# EAGLE design avr-doper-alt (EAGLE 5.06)
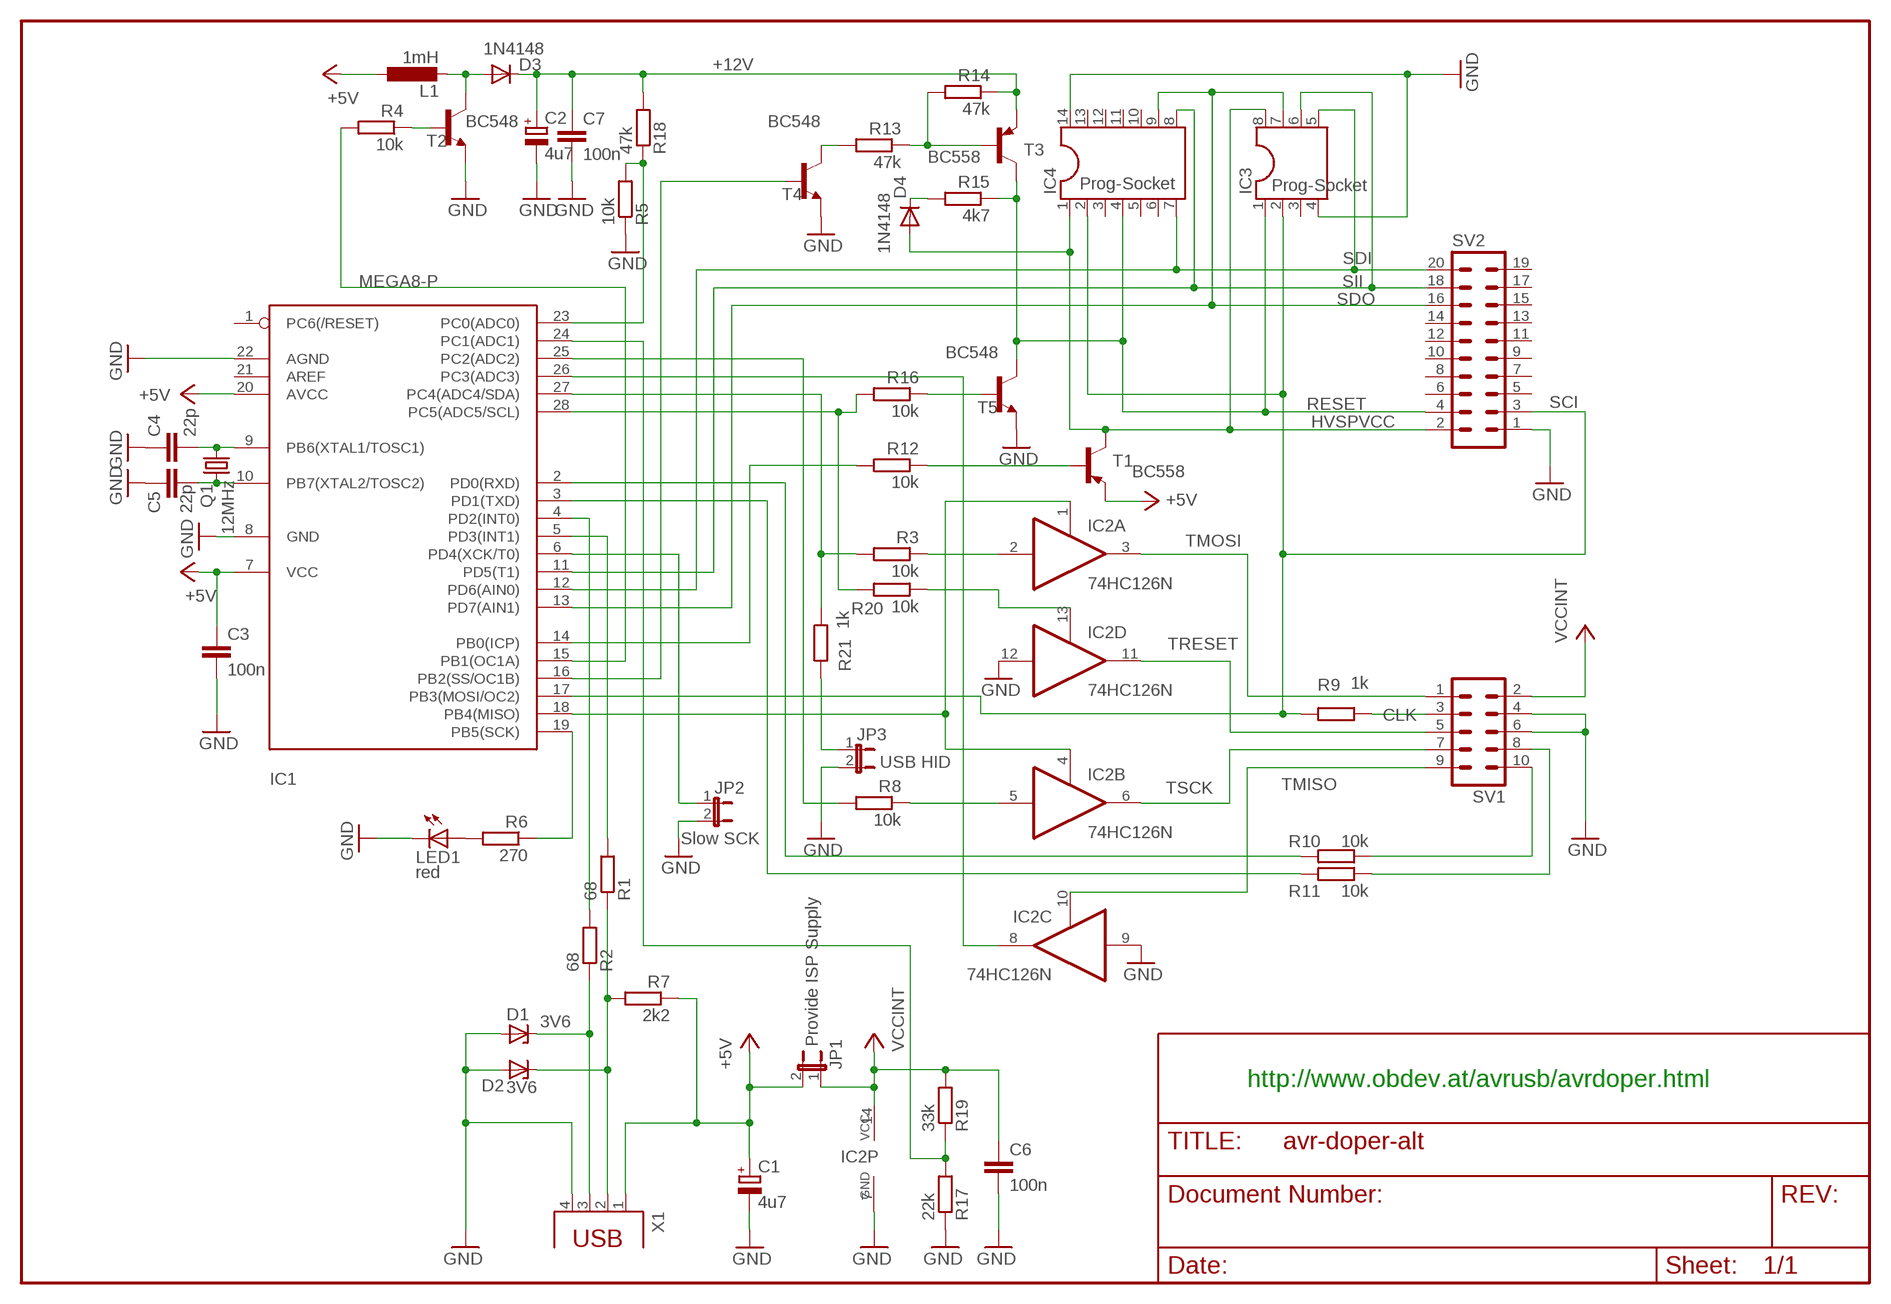
[diagram p0: schematic, sheet 1]

## Parts
C1  4u7  CPOL-EUE2.5-5  [E2,5-5]
C2  4u7  CPOL-EUE2.5-5  [E2,5-5]
C3  100n  C-EU025-024X044  [C025-024X044]
C4  22p  C-EU025-024X044  [C025-024X044]
C5  22p  C-EU025-024X044  [C025-024X044]
C6  100n  C-EU025-024X044  [C025-024X044]
C7  100n  C-EU025-024X044  [C025-024X044]
D1  3V6  ZENER-DIODEDO35Z10  [DO35Z10]
D2  3V6  ZENER-DIODEDO34-7  [DO34Z7]
D3  1N4148  1N41487MM  [DO35-7]
D4  1N4148  1N41487MM  [DO35-7]
IC1  MEGA8-P  [DIL28-3]
IC2  74HC126N  [DIL14]
IC3  Prog-Socket  DIL8S  [SOCKED-08]
IC4  Prog-Socket  DIL14S  [SOCKED-14]
JP1  Provide ISP Supply  JP1E  [JP1]
JP2  Slow SCK  JP1E  [JP1]
JP3  USB HID  JP1E  [JP1]
L1  1mH  L-EU0207/10  [0207/10]
LED1  red  LED3MM  [LED3MM]
Q1  12MHz  CRYTALHC49S  [HC49/S]
R1  68  R-EU_0207/12  [0207/12]
R2  68  R-EU_0207/10  [0207/10]
R3  10k  R-EU_0207/10  [0207/10]
R4  10k  R-EU_0207/10  [0207/10]
R5  10k  R-EU_0207/10  [0207/10]
R6  270  R-EU_0207/10  [0207/10]
R7  2k2  R-EU_0207/10  [0207/10]
R8  10k  R-EU_0207/10  [0207/10]
R9  1k  R-EU_0207/10  [0207/10]
R10  10k  R-EU_0207/10  [0207/10]
R11  10k  R-EU_0207/10  [0207/10]
R12  10k  R-EU_0207/10  [0207/10]
R13  47k  R-EU_0207/10  [0207/10]
R14  47k  R-EU_0207/10  [0207/10]
R15  4k7  R-EU_0207/10  [0207/10]
R16  10k  R-EU_0207/10  [0207/10]
R17  22k  R-EU_0207/10  [0207/10]
R18  47k  R-EU_0207/10  [0207/10]
R19  33k  R-EU_0207/15  [0207/15]
R20  10k  R-EU_0207/10  [0207/10]
R21  1k  R-EU_0207/12  [0207/12]
SV1  ML10L  [ML10L]
SV2  ML20L  [ML20L]
T1  BC558  -PNP-TO92/  [TO92/]
T2  BC548  2N930-NPN-TO18-EBC  [TO18]
T3  BC558  -PNP-TO92/  [TO92/]
T4  BC548  2N930-NPN-TO18-EBC  [TO18]
T5  BC548  2N930-NPN-TO18-EBC  [TO18]
X1  PN61729  [PN61729]

## Nets
+5V: C1.+ C3.1 IC1.7(VCC) IC1.20(AVCC) JP1.2 L1.1 R7.1 T1.1(E) X1.1
+12V: C2.+ C7.1 D3.C R14.1 R18.2 T3.1(E)
CLK: R9.1 SV1.3
GND: C1.- C2.- C3.2 C4.1 C5.1 C6.2 C7.2 D1.A D2.A IC1.8(GND) IC1.22(AGND) IC2.7(P:GND) IC2.9(C:I) IC2.12(D:I) IC3.4 IC4.14 JP2.2 JP3.2 LED1.K(C) R5.1 R17.1 SV1.4 SV1.6 SV2.1 T2.1(E) T4.1(E) T5.1(E) X1.4
HVSPVCC: D4.A IC3.8 IC4.1 SV2.2 T1.3(C)
N$1: IC1.18(PB4(MISO)) IC2.1(A:OE) IC2.4(B:OE)
N$2: IC2.2(A:I) R3.1
N$3: IC2.5(B:I) R8.1
N$4: IC1.27(PC4(ADC4/SDA)) R3.2 R21.1
N$5: D2.C R1.1 R7.2 X1.2
N$6: IC1.25(PC2(ADC2)) R8.2
N$7: IC1.4(PD2(INT0)) R2.2
N$8: D1.C R2.1 X1.3
N$9: IC1.28(PC5(ADC5/SCL)) R16.2 R20.2
N$10: IC1.26(PC3(ADC3)) IC2.8(C:O)
N$11: IC1.24(PC1(ADC1)) R17.2 R19.1
N$12: R10.1 SV1.10
N$13: IC1.2(PD0(RXD)) R10.2
N$14: IC1.3(PD1(TXD)) R11.2
N$15: R11.1 SV1.8
N$18: R12.1 T1.2(B)
N$19: IC1.14(PB0(ICP)) R12.2
N$20: IC2.13(D:OE) R20.1
N$21: IC1.5(PD3(INT1)) R1.2
N$22: C4.2 IC1.9(PB6(XTAL1/TOSC1)) Q1.2
N$23: C5.2 IC1.10(PB7(XTAL2/TOSC2)) Q1.1
N$25: LED1.A R6.2
N$26: IC1.15(PB1(OC1A)) R4.2
N$27: D3.A L1.2 T2.3(C)
N$29: R4.1 T2.2(B)
N$30: R13.2 T4.3(C)
N$31: R13.1 R14.2 T3.2(B)
N$32: JP3.1 R21.2
N$33: IC1.23(PC0(ADC0)) R5.2 R18.1
N$34: D4.C R15.2
N$35: R16.1 T5.2(B)
N$37: IC1.16(PB2(SS/OC1B)) T4.2(B)
N$38: IC1.6(PD4(XCK/T0)) JP2.1
N$39: IC1.19(PB5(SCK)) R6.1
RESET: IC3.1 IC4.4 R15.1 SV2.4 T3.3(C) T5.3(C)
SCI: IC1.17(PB3(MOSI/OC2)) IC3.2 IC4.2 R9.2 SV2.3
SDI: IC1.12(PD6(AIN0)) IC3.5 IC4.7 SV2.20
SDO: IC1.13(PD7(AIN1)) IC3.7 IC4.9 SV2.16
SII: IC1.11(PD5(T1)) IC3.6 IC4.8 SV2.18
TMISO: IC2.10(C:OE) SV1.9
TMOSI: IC2.3(A:O) SV1.1
TRESET: IC2.11(D:O) SV1.5
TSCK: IC2.6(B:O) SV1.7
VCCINT: C6.1 IC2.14(P:VCC) JP1.1 R19.2 SV1.2
Unconnected: IC1.1(PC6(/RESET)) IC1.21(AREF) IC3.3 IC4.3 IC4.5 IC4.6 IC4.10 IC4.11 IC4.12 IC4.13 SV2.5 SV2.6 SV2.7 SV2.8 SV2.9 SV2.10 SV2.11 SV2.12 SV2.13 SV2.14 SV2.15 SV2.17 SV2.19

## Notes on the sheet
- http://www.obdev.at/avrusb/avrdoper.html

## Library data of the parts
C1 C2 = rcl:CPOL-EU: POLARIZED CAPACITOR, European symbol
C3-C7 = rcl:C-EU: CAPACITOR, European symbol
D1 D2 = diode:ZENER-DIODE: Z-Diode
D3 D4 = diode:1N4148: DIODE high speed (Philips)
IC1 = atmel:MEGA8-P: MICROCONTROLLER 8 Kbytes FLASH 1 kbytes SRAM 512 bytes EEPROM USART 4-channel 10 bit ADC 2-channel 8 bit ADC Source: avr.lbr
IC2 = 74xx-eu:74*126: Quad bus BUFFER, 3-state
IC3 = ic-package:DIL8: Dual In Line
IC4 = ic-package:DIL14: Dual In Line
JP1-JP3 = jumper:JP1E: JUMPER
L1 = rcl:L-EU: INDUCTOR, European symbol
LED1 = led:LED: LED OSRAM: - CHIPLED LG R971, LG N971, LY N971, LG Q971, LY Q971, LO R971, LY R971 LH N974, LH R974 LS Q976, LO Q976, LY Q976 LO Q996 - Hyper CHIPLED LW Q18S LB Q993, LB Q99A, LB R99A - SideLED LS A670, LO A670, LY A670, LG A670, LP A670 LB A673, LV A673, LT A673, LW A673 LH A674 LY A675 LS A676, LA A676, LO A676, LY A676, LW A676 LS A679, LY A679, LG A679 - Hyper Micro SIDELED® LS Y876, LA Y876, LO Y876, LY Y876 LT Y87S - SmartLED LW L88C, LW L88S LB L89C, LB L89S, LG L890 LS L89K, LO L89K, LY L89K LS L896, LA L896, LO L896, LY L896 - TOPLED LS T670, LO T670, LY T670, LG T670, LP T670 LSG T670, LSP T670, LSY T670, LOP T670, LYG T670 LG T671, LOG T671, LSG T671 LB T673, LV T673, LT T673, LW T673 LH T674 LS T676, LA T676, LO T676, LY T676, LB T676, LH T676, LSB T676, LW T676 LB T67C, LV T67C, LT T67C, LS T67K, LO T67K, LY T67K, LW E67C LS E67B, LA E67B, LO E67B, LY E67B, LB E67C, LV E67C, LT E67C LW T67C LS T679, LY T679, LG T679 LS T770, LO T770, LY T770, LG T770, LP T770 LB T773, LV T773, LT T773, LW T773 LH T774 LS E675, LA E675, LY E675, LS T675 LS T776, LA T776, LO T776, LY T776, LB T776 LHGB T686 LT T68C, LB T68C - Hyper Mini TOPLED® LB M676 - Mini TOPLED Santana® LG M470 LS M47K, LO M47K, LY M47K Source: http://www.osram.convergy.de/
Q1 = crystal:CRYTAL: CRYSTAL
R1-R21 = rcl:R-EU_: RESISTOR, European symbol
SV1 = con-harting-ml:ML10: HARTING
SV2 = con-harting-ml:ML20: HARTING
T1 T3 = transistor:*-PNP-: PNP Transistror
T2 T4 T5 = transistor:*-NPN-: NPN Transistror
X1 = con-berg:PN61729: BERG USB connector

## Board
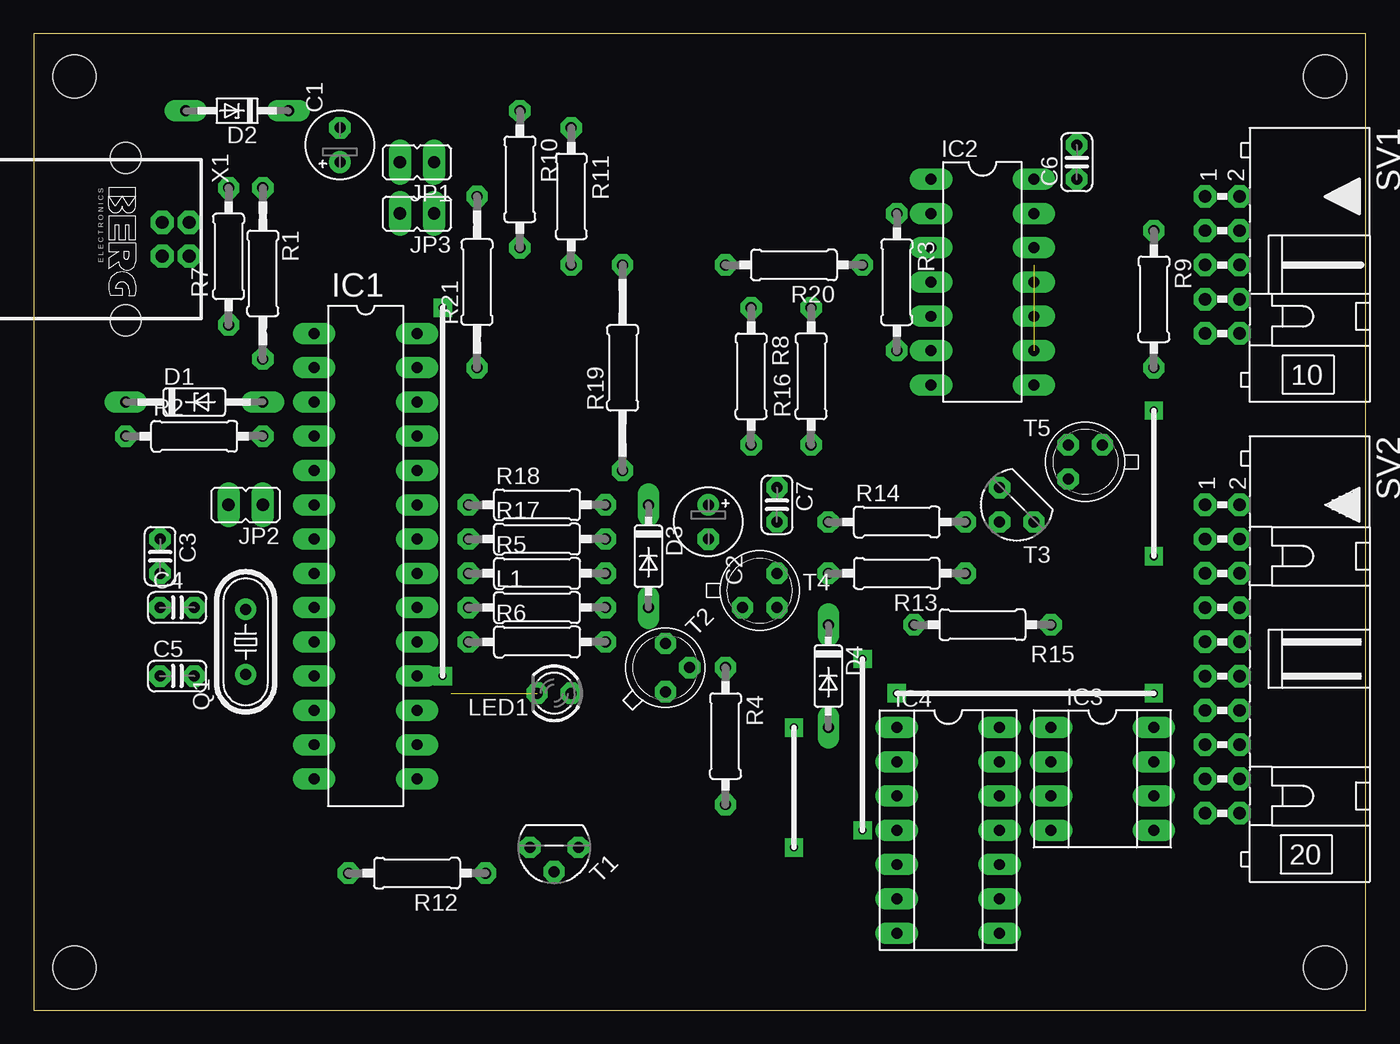
[diagram p1: board, top side]
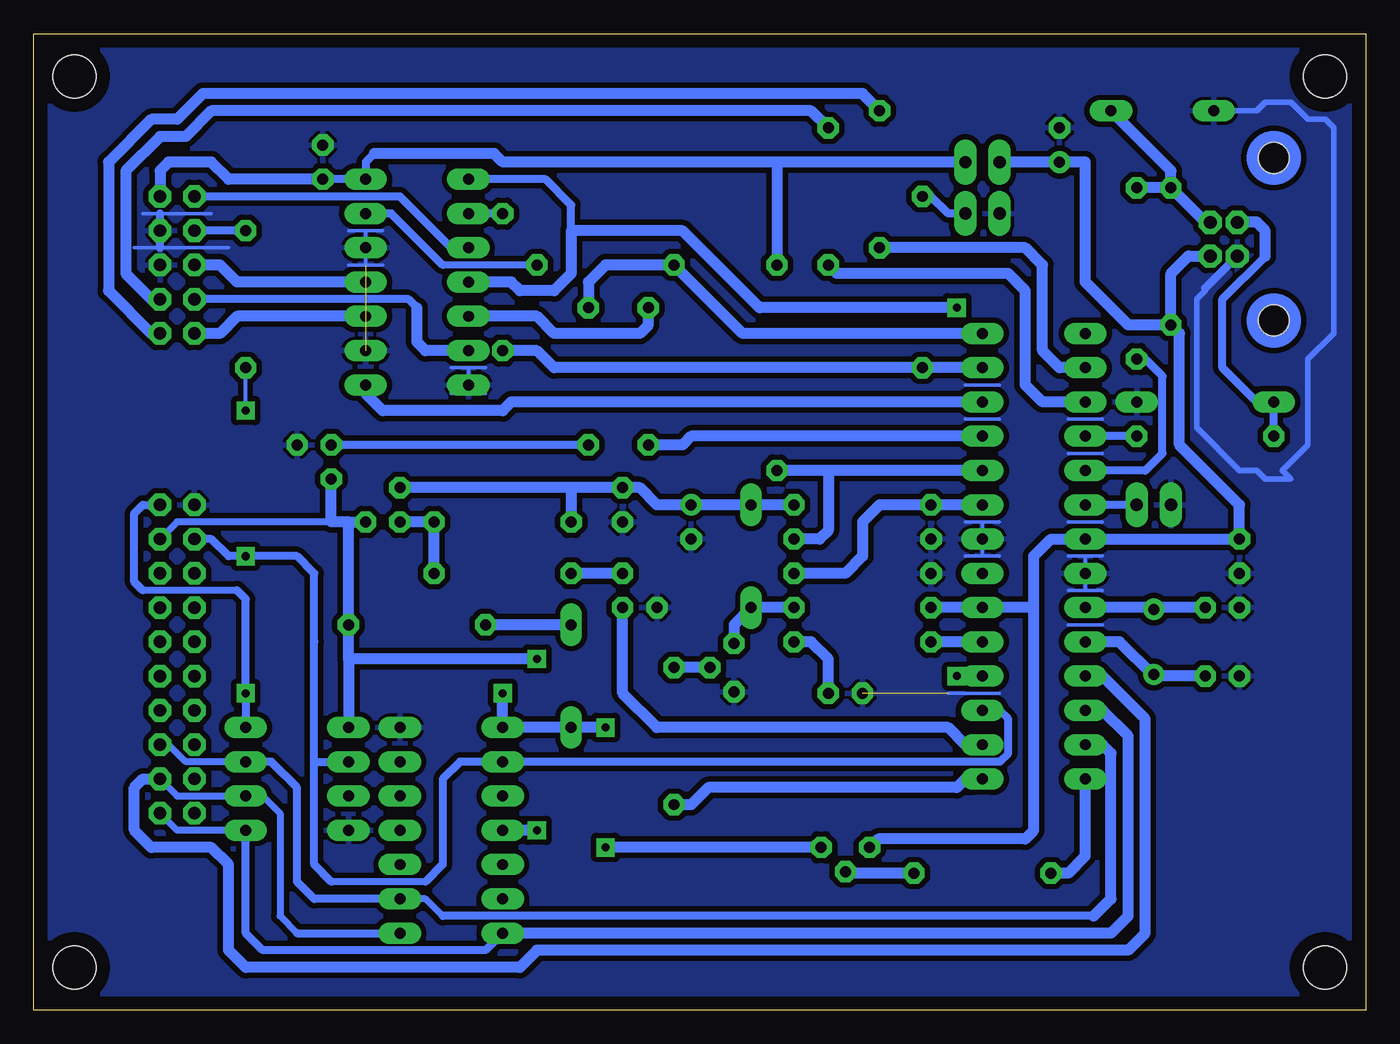
[diagram p2: board, bottom side, seen from below]

Size 98.73 x 72.38 mm. Coordinates in mm from the lower left corner, seen from the top.
Outline: 0,0 98.73,0 98.73,72.38 0,72.38 0,0
Copper layers 16: Bottom 0.035mm
Design rules "default": minimum track width 12mil, minimum drill 31mil, track to track 8mil, track to pad 8mil, pad to pad 8mil, via to via 8mil, smd to smd 8mil, copper to edge 40mil, drill to drill 8mil, minimum pad ring 15mil, minimum via ring 15mil, stop-mask expansion 4mil, vias tented up to drill 0mil, thermal gap 10mil
Holes 3.2 mm at 3.01,69.21 3.01,3.17 95.72,3.17 95.72,69.21

### Footprints (pad centres in the part's own frame; a part is rotated, then mirrored left to right if it is on the bottom)
E2,5-5 = drill 0.813 pad 1.6 round: + -1.27,0 | drill 0.813 pad 1.6 octagon: - 1.27,0
C025-024X044 = drill 0.813 octagon: 1 -1.27,0; 2 1.27,0
DO35Z10 = drill 0.813 long: A 5.08,0; C -5.08,0
DO34Z7 = drill 0.813 long: A 3.81,0; C -3.81,0
DO35-7 = drill 0.813 long: A 3.81,0; C -3.81,0
DIL28-3 = drill 0.813 long: 1 -16.51,-3.81; 2 -13.97,-3.81; 3 -11.43,-3.81; 4 -8.89,-3.81; 5 -6.35,-3.81; 6 -3.81,-3.81; 7 -1.27,-3.81; 8 1.27,-3.81; 9 3.81,-3.81; 10 6.35,-3.81; 11 8.89,-3.81; 12 11.43,-3.81; 13 13.97,-3.81; 14 16.51,-3.81; 15 16.51,3.81; 16 13.97,3.81; 17 11.43,3.81; 18 8.89,3.81; 19 6.35,3.81; 20 3.81,3.81; 21 1.27,3.81; 22 -1.27,3.81; 23 -3.81,3.81; 24 -6.35,3.81; 25 -8.89,3.81; 26 -11.43,3.81; 27 -13.97,3.81; 28 -16.51,3.81
DIL14 = drill 0.813 long: 1 -7.62,-3.81; 2 -5.08,-3.81; 3 -2.54,-3.81; 4 0,-3.81; 5 2.54,-3.81; 6 5.08,-3.81; 7 7.62,-3.81; 8 7.62,3.81; 9 5.08,3.81; 10 2.54,3.81; 11 0,3.81; 12 -2.54,3.81; 13 -5.08,3.81; 14 -7.62,3.81
SOCKED-08 = drill 0.813 long: 1 -3.81,-3.81; 2 -1.27,-3.81; 3 1.27,-3.81; 4 3.81,-3.81; 5 3.81,3.81; 6 1.27,3.81; 7 -1.27,3.81; 8 -3.81,3.81
SOCKED-14 = drill 0.813 long: 1 -7.62,-3.81; 2 -5.08,-3.81; 3 -2.54,-3.81; 4 0,-3.81; 5 2.54,-3.81; 6 5.08,-3.81; 7 7.62,-3.81; 8 7.62,3.81; 9 5.08,3.81; 10 2.54,3.81; 11 0,3.81; 12 -2.54,3.81; 13 -5.08,3.81; 14 -7.62,3.81
JP1 = drill 0.914 long: 1 0,-1.27; 2 0,1.27
0207/10 = drill 0.813 octagon: 1 -5.08,0; 2 5.08,0
LED3MM = drill 0.813 octagon: A -1.27,0; K 1.27,0
HC49/S = drill 0.813 round: 1 -2.413,0; 2 2.413,0
0207/12 = drill 0.813 octagon: 1 -6.35,0; 2 6.35,0
0207/15 = drill 0.813 octagon: 1 -7.62,0; 2 7.62,0
ML10L = drill 0.914 octagon: 1 -5.08,-1.27; 2 -5.08,1.27; 3 -2.54,-1.27; 4 -2.54,1.27; 5 0,-1.27; 6 0,1.27; 7 2.54,-1.27; 8 2.54,1.27; 9 5.08,-1.27; 10 5.08,1.27
ML20L = drill 0.914 octagon: 1 -11.43,-1.27; 2 -11.43,1.27; 3 -8.89,-1.27; 4 -8.89,1.27; 5 -6.35,-1.27; 6 -6.35,1.27; 7 -3.81,-1.27; 8 -3.81,1.27; 9 -1.27,-1.27; 10 -1.27,1.27; 11 1.27,-1.27; 12 1.27,1.27; 13 3.81,-1.27; 14 3.81,1.27; 15 6.35,-1.27; 16 6.35,1.27; 17 8.89,-1.27; 18 8.89,1.27; 19 11.43,-1.27; 20 11.43,1.27
TO92/ = drill 0.813 octagon: 1 1.27,-1.27; 2 1.27,1.27; 3 -1.27,1.27
TO18 = drill 0.813 octagon: 1 -1.27,-1.27; 2 1.27,-1.27; 3 1.27,1.27
PN61729 = drill 0.95 octagon: 1 1.25,4.71; 2 -1.25,4.71; 3 -1.25,2.71; 4 1.25,2.71 | hole 2.3: -6.02,0; 6.02,0

### Placement (x,y rotation side)
C1  22.7,64.13 90 top
C2  50,36.19 270 top
C3  9.36,33.65 270 top
C4  10.63,29.84 0 top
C5  10.63,24.76 0 top
C6  77.3,62.86 90 top
C7  55.08,37.46 270 top
D1  11.9,45.08 0 top
D2  15.08,66.67 180 top
D3  45.55,33.65 270 top
D4  58.89,24.76 270 top
IC1  24.6,33.65 270 top
IC2  70.32,53.97 270 top
IC3  79.21,17.14 270 top
IC4  67.78,13.33 270 top
JP1  28.41,62.86 90 top
JP2  15.71,37.46 90 top
JP3  28.41,59.05 90 top
L1  37.3,29.84 0 top
LED1  38.57,23.49 180 top
Q1  15.71,27.3 90 top
R1  16.98,54.61 270 top
R2  11.9,42.54 0 top
R3  63.97,53.97 270 top
R4  51.27,20.31 270 top
R5  37.3,32.38 0 top
R6  37.3,27.3 0 top
R7  14.44,55.88 90 top
R8  53.17,46.98 270 top
R9  83.02,52.7 270 top
R10  36.03,61.59 270 top
R11  39.84,60.32 270 top
R12  28.41,10.16 180 top
R13  63.97,32.38 180 top
R14  63.97,36.19 0 top
R15  70.32,28.57 180 top
R16  57.62,46.98 90 top
R17  37.3,34.92 0 top
R18  37.3,37.46 0 top
R19  43.65,47.62 90 top
R20  56.35,55.24 180 top
R21  32.85,53.97 90 top
SV1  88.1,55.24 270 top
SV2  88.1,26.03 270 top
T1  38.57,12.06 225 top
T2  46.82,25.39 45 top
T3  72.86,37.46 180 top
T4  53.81,31.11 0 top
T5  77.94,40.64 180 top
X1  6.82,57.15 270 top

### Tracks (layer width: path | path; a pad name or v marks a point on that pad's centre or on a via)
+5V
  Bottom 0.813: L1.1 IC1.20 24.6,29.84 | 24.6,29.84 24.6,33.65 23.33,34.92 IC1.7 C3.1 9.36,37.46 13.81,41.91 13.81,50.16 R7.1 | T1.1 36.14,12.7 25.23,12.7 24.6,13.33 24.6,29.84 | R7.1 17.61,50.8 20.79,53.97 20.79,62.86 C1.+ JP1.2 | R7.1 14.44,54.61 13.15,55.9 X1.1
+12V
  Bottom 0.813: R18.2 D3.C C2.+ 52.54,37.46 53.81,38.73 C7.1 58.89,38.73 | 58.89,38.73 R14.1 | 58.89,38.73 T3.1
CLK
  Bottom 0.61: R9.1 SV1.3
GND  (2 unrouted)
  Bottom 0.254: 84.29,56.51 89.37,56.51 91.28,56.51 | 27.14,46.35 29.68,46.35 | 27.14,43.81 29.68,43.81 | 27.14,23.49 30.95,23.49 | 19.52,43.81 22.06,43.81 | 19.52,41.27 22.06,41.27 | 19.52,36.19 22.06,36.19 | 19.52,28.57 22.06,28.57 | 20.79,33.65 19.52,33.65 | 20.79,33.65 22.06,33.65 | 19.52,31.11 20.79,31.11 | 20.79,31.11 22.06,31.11 | 20.79,31.11 20.79,33.65 | 28.41,36.19 27.14,36.19 | 28.41,36.19 29.68,36.19 | 27.14,33.65 28.41,33.65 | 28.41,33.65 29.68,33.65 | 28.41,33.65 28.41,36.19 | 85.56,59.05 89.37,59.05 90.64,59.05 | 74.13,57.78 72.86,57.78 | 74.13,57.78 75.4,57.78 | 74.13,57.78 IC2.12 74.13,55.24 | 72.86,55.24 74.13,55.24 | 74.13,55.24 75.4,55.24 | 65.24,45.72 66.51,45.72 | 66.51,45.72 67.78,45.72 | 66.51,47.62 65.24,47.62 | 66.51,47.62 67.78,47.62 | 66.51,45.72 IC2.7 66.51,47.62
  Bottom 0.406: 11.9,53.53 11.9,53.34 12.54,52.7 12.54,43.18 9.36,40 8.09,40 7.46,39.37 5.55,39.37 6.18,40 4.28,41.91 4.28,48.26 2.38,50.16 2.38,65.4 3.01,66.03 4.28,66.03 5.55,67.3 7.46,67.3 8.09,66.67 D2.A
  Bottom 0.61: 89.37,56.51 89.37,59.05 | 11.9,53.53 X1.4
  pour Bottom (isolate 0.406): 0.47,71.75 0.47,0.63 98.26,0.63 98.26,71.75
HVSPVCC  (via drill 0.6)
  Top 0.406: v63.97,23.49 v83.02,23.49 | v56.35,12.06 v56.35,20.95
  Bottom 0.508: 83.66,31.11 90.64,31.11
  Bottom 0.61: 83.66,31.11 83.02,30.47 v83.02,23.49 IC3.8 | 90.64,31.11 91.28,31.74 91.28,36.83 90.64,37.46 SV2.2
  Bottom 0.813: v63.97,23.49 IC4.1 D4.A v56.35,20.95 | T1.3 v56.35,12.06
N$1  (via drill 0.6)
  Top 0.406: v30.31,24.76 v30.31,52.07
  Bottom 0.61: IC2.1 60.8,61.59 58.89,59.69 58.89,57.78
  Bottom 0.813: v30.31,52.07 44.92,52.07 50.63,57.78 58.89,57.78 58.89,54.61 60.16,53.34 62.7,53.34 63.34,53.97 IC2.4 | IC1.18 v30.31,24.76
N$2
  Bottom 0.61: R3.1 IC2.2
N$3
  Bottom 0.813: R8.1 53.17,50.8 53.81,50.16 60.16,50.16 61.43,51.43 IC2.5
N$4
  Bottom 0.813: IC1.27 R21.1 60.16,47.62 61.43,48.89 R3.2
N$5
  Bottom 0.406: X1.2 11.88,58.4
  Bottom 0.61: X1.2 11.55,58.41
  Bottom 0.813: D2.C 14.44,62.23 R7.2 | R7.2 R1.1 | 11.88,58.4 R7.2
N$6
  Bottom 0.813: IC1.25 50,42.54 50.63,41.91 R8.2
N$7
  Bottom 0.61: R2.2 IC1.4
N$8
  Bottom 0.406: 9.36,58.41 X1.3
  Bottom 0.61: R2.1 D1.C 8.09,45.08 10.63,47.62 10.63,52.7 7.46,55.88
  Bottom 0.813: 9.36,58.41 8.09,58.41 7.46,57.78 7.46,55.88
N$9
  Bottom 0.813: IC1.28 46.19,50.16 R20.2 56.35,55.24 57.62,53.97 R16.2
N$10
  Bottom 0.61: 74.13,45.72 IC2.8
  Bottom 0.813: IC1.26 63.34,45.08 63.97,44.45 72.86,44.45 74.13,45.72
N$11
  Bottom 0.305: R19.1 39.84,40
  Bottom 0.813: IC1.24 R19.1 | R17.2 40.48,34.92 39.84,35.55 39.84,40
N$12
  Bottom 0.813: R10.1 37.3,67.94 86.19,67.94 88.1,66.03 90,66.03 93.18,62.86 93.18,53.34 90,50.16 SV1.10
N$13
  Bottom 0.813: IC1.2 22.7,47.62 23.96,48.89 23.96,55.24 25.23,56.51 R10.2
N$14
  Bottom 0.61: 39.2,54.61 R11.2
  Bottom 0.813: IC1.3 23.96,45.08 25.23,46.35 25.23,53.34 26.5,54.61 39.2,54.61
N$15
  Bottom 0.813: R11.1 41.11,66.67 85.56,66.67 87.47,64.77 89.37,64.77 91.91,62.23 91.91,54.61 90,52.7 SV1.8
N$18
  Bottom 0.406: 38.57,10.16 T1.2
  Bottom 0.813: R12.1 38.57,10.16
N$19
  Bottom 0.813: IC1.14 20.79,11.43 22.06,10.16 R12.2
N$20
  Bottom 0.508: R20.1 68.41,55.24
  Bottom 0.61: 68.41,55.24 72.22,59.05 IC2.13
N$21
  Bottom 0.61: IC1.5 16.34,40 15.08,41.27 15.08,46.98 16.34,48.26 R1.2
N$22
  Bottom 0.61: 15.08,29.84 Q1.2 16.34,29.84
  Bottom 0.813: C4.2 15.08,29.84 | 16.34,29.84 IC1.9
N$23
  Bottom 0.305: 15.71,24.76 Q1.1
  Bottom 0.813: IC1.10 18.25,27.3 15.71,24.76 C5.2
N$25
  Bottom 0.813: R6.2 41.11,27.3 39.84,26.03 LED1.A 39.84,24.76
N$26
  Bottom 0.813: IC1.15 29.68,17.14 30.31,16.5 48.73,16.5 50,15.24 R4.2
N$27
  Bottom 0.813: T2.3 46.82,28.57 D3.A L1.2
N$29
  Bottom 0.813: T2.2 R4.1
N$30
  Bottom 0.813: T4.3 R13.2
N$31
  Bottom 0.813: R13.1 R14.2 T3.2
N$32
  Bottom 0.61: JP3.1 30.95,59.05 32.22,60.32 R21.2
N$33
  Bottom 0.813: IC1.23 R18.1 36.03,37.46 37.3,36.19 37.3,33.65 38.57,32.38 R5.2
N$34
  Bottom 0.813: D4.C R15.2
N$35
  Bottom 0.61: R16.1 T5.2
N$37
  Bottom 0.813: IC1.16 29.68,19.68 30.95,20.95 52.54,20.95 55.08,23.49 T4.2
N$38
  Bottom 0.61: JP2.1 IC1.6
N$39
  Bottom 0.813: IC1.19 R6.1
RESET  (via drill 0.6)
  Top 0.406: v61.43,13.33 v61.43,26.03
  Bottom 0.508: SV2.4 88.1,36.19 76.67,36.19
  Bottom 0.813: 75.4,26.03 IC3.1 | 75.4,26.03 R15.1 75.4,36.19 | 75.4,36.19 T3.3 | 75.4,36.19 76.67,36.19 T5.3 | v61.43,13.33 IC4.4 | v61.43,26.03 75.4,26.03
SCI  (via drill 0.6)
  Top 0.406: v83.02,33.65 v83.02,44.45
  Bottom 0.305: v83.02,44.45 R9.2
  Bottom 0.406: 77.94,27.3 77.94,26.66
  Bottom 0.508: 69.69,9.52 76.67,9.52
  Bottom 0.61: IC1.17 27.14,22.22 26.5,21.58 26.5,19.04 27.14,18.41 IC4.2 67.14,18.41 68.41,17.14 68.41,10.79 69.69,9.52 | SV2.3 85.56,34.92 84.29,33.65 v83.02,33.65 79.21,33.65 77.94,32.38 77.94,27.3 77.94,18.41 | 76.67,9.52 77.94,10.79 77.94,18.41 | 77.94,18.41 IC3.2
SDI
  Bottom 0.508: SV2.20 88.1,13.33 IC3.5
  Bottom 0.61: IC3.5 83.02,5.71 81.75,4.44 65.24,4.44 IC4.7
  Bottom 0.813: IC1.12 19.52,22.22 17.61,20.31 17.61,6.98 18.88,5.71 IC4.7
SDO
  Bottom 0.305: 88.73,19.68 SV2.16
  Bottom 0.508: 68.41,6.98 69.69,8.25 IC4.9 | 88.73,19.68 87.47,18.41 IC3.7
  Bottom 0.61: IC4.9 77.94,8.25 79.21,9.52 79.21,16.5 81.11,18.41 IC3.7 | 20.15,6.98 68.41,6.98
  Bottom 0.813: IC1.13 19.52,19.68 18.88,19.04 18.88,8.25 20.15,6.98
SII
  Bottom 0.508: 79.21,5.71 80.48,6.98 80.48,14.6 81.75,15.87 IC3.6 88.1,15.87 SV2.18
  Bottom 0.61: 79.21,5.71 IC4.8
  Bottom 0.813: IC1.11 19.52,24.76 16.34,21.58 16.34,5.71 17.61,4.44 61.43,4.44 62.7,3.17 83.02,3.17 84.29,4.44 84.29,10.79 85.56,12.06 90,12.06 91.28,13.33 91.28,16.5 90.64,17.14 SV2.18
TMISO
  Bottom 0.813: IC2.10 83.66,51.43 84.92,50.16 SV1.9
TMOSI
  Bottom 0.61: IC2.3 67.78,56.51 71.59,60.32 SV1.1
TRESET
  Bottom 0.813: IC2.11 83.66,53.97 84.92,55.24 SV1.5
TSCK
  Bottom 0.61: 70.32,52.07 70.95,52.7 SV1.7
  Bottom 0.813: 70.32,52.07 70.32,49.53 69.69,48.89 IC2.6
VCCINT
  Bottom 0.61: 73.5,63.5 74.13,62.86 IC2.14 C6.1
  Bottom 0.813: 43.65,62.86 R19.2 | SV1.2 89.37,62.23 88.73,62.86 85.56,62.86 84.29,61.59 C6.1 | 43.65,62.86 63.97,62.86 64.61,63.5 73.5,63.5 | JP1.1 43.65,62.86
(copper drawn outside any net)
  shapes: Bottom circle x2